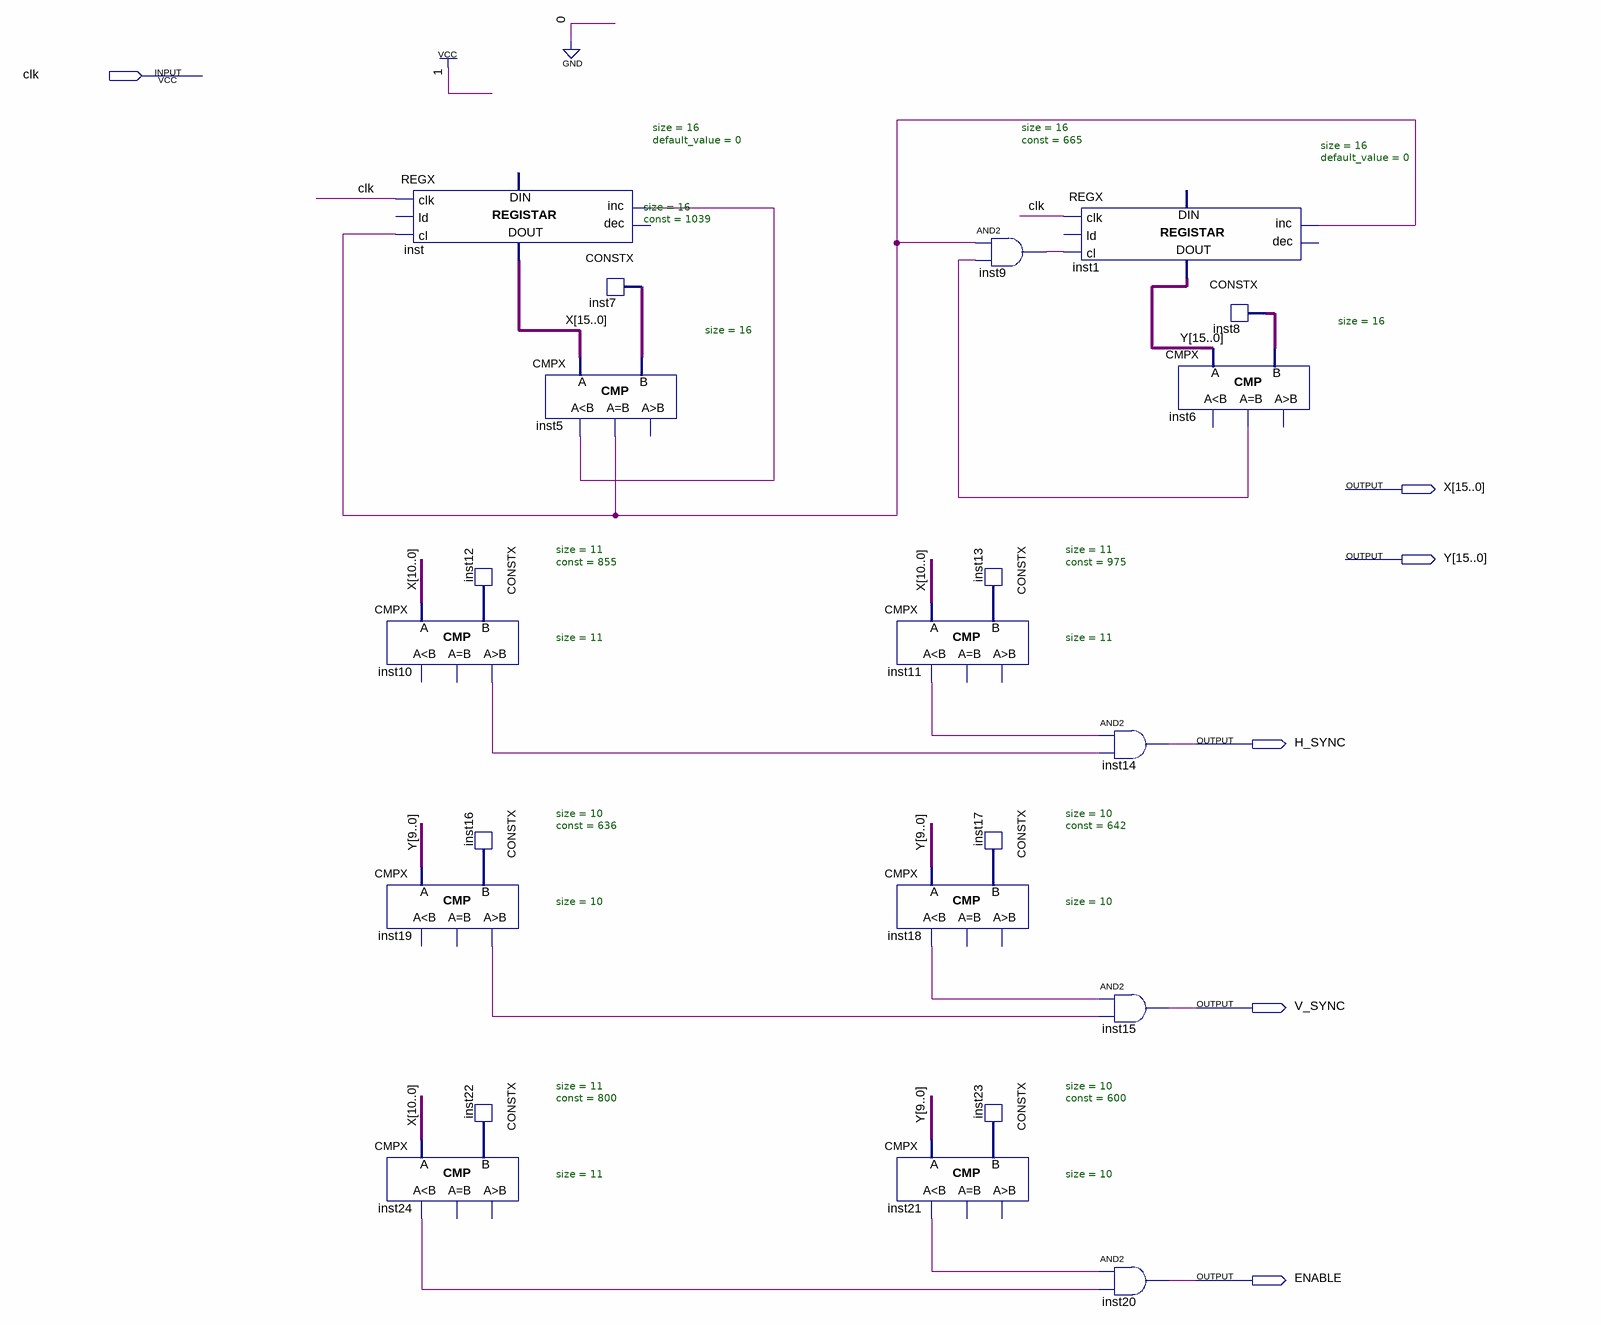
[diagram p0: schematic sheet]
// Quartus schematic VGA.bdf as structural Verilog: 22 symbols, 6 pins
module VGA (
  input  clk,
  output [15:0] X,
  output [15:0] Y,
  output H_SYNC,
  output V_SYNC,
  output ENABLE
);

  wire inst5_eq, inst5_ls, inst6_eq, inst9_out, inst10_gr, inst11_ls, inst18_ls, inst19_gr, inst21_ls,
       inst24_ls;
  wire [9:0] inst16_data, inst17_data, inst23_data;
  wire [10:0] inst12_data, inst13_data, inst22_data;
  wire [15:0] inst7_data, inst8_data;

  REGX #(.size(16), .default_value(0)) inst (
    .clk(clk), .cl(inst5_eq), .inc(inst5_ls), .data_out(X));  // open: ld, dec, data_in
  CMPX #(.size(11)) inst10 (.A(X[10:0]), .B(inst12_data), .gr(inst10_gr));  // open: ls, eq
  CMPX #(.size(10)) inst19 (.A(Y[9:0]), .B(inst16_data), .gr(inst19_gr));  // open: ls, eq
  CMPX #(.size(11)) inst24 (.A(X[10:0]), .B(inst22_data), .ls(inst24_ls));  // open: eq, gr
  CONSTX #(.size(11), .\const (855)) inst12 (.data(inst12_data));
  CONSTX #(.size(10), .\const (636)) inst16 (.data(inst16_data));
  CONSTX #(.size(11), .\const (800)) inst22 (.data(inst22_data));
  CMPX #(.size(16)) inst5 (.A(X), .B(inst7_data), .ls(inst5_ls), .eq(inst5_eq));  // open: gr
  CONSTX #(.size(16), .\const (1039)) inst7 (.data(inst7_data));
  CMPX #(.size(11)) inst11 (.A(X[10:0]), .B(inst13_data), .ls(inst11_ls));  // open: eq, gr
  CMPX #(.size(10)) inst18 (.A(Y[9:0]), .B(inst17_data), .ls(inst18_ls));  // open: eq, gr
  CMPX #(.size(10)) inst21 (.A(Y[9:0]), .B(inst23_data), .ls(inst21_ls));  // open: eq, gr
  CONSTX #(.size(11), .\const (975)) inst13 (.data(inst13_data));
  CONSTX #(.size(10), .\const (642)) inst17 (.data(inst17_data));
  CONSTX #(.size(10), .\const (600)) inst23 (.data(inst23_data));
  and inst9 (inst9_out, inst5_eq, inst6_eq);
  REGX #(.size(16), .default_value(0)) inst1 (
    .clk(clk), .cl(inst9_out), .inc(inst5_eq), .data_out(Y));  // open: ld, dec, data_in
  and inst14 (H_SYNC, inst11_ls, inst10_gr);
  and inst15 (V_SYNC, inst18_ls, inst19_gr);
  and inst20 (ENABLE, inst21_ls, inst24_ls);
  CMPX #(.size(16)) inst6 (.A(Y), .B(inst8_data), .eq(inst6_eq));  // open: ls, gr
  CONSTX #(.size(16), .\const (665)) inst8 (.data(inst8_data));
endmodule
